# Altium schematic sheet MCP23017_PINOUT.SchDoc
size B; SheetNumber: 11; SheetTotal: 15
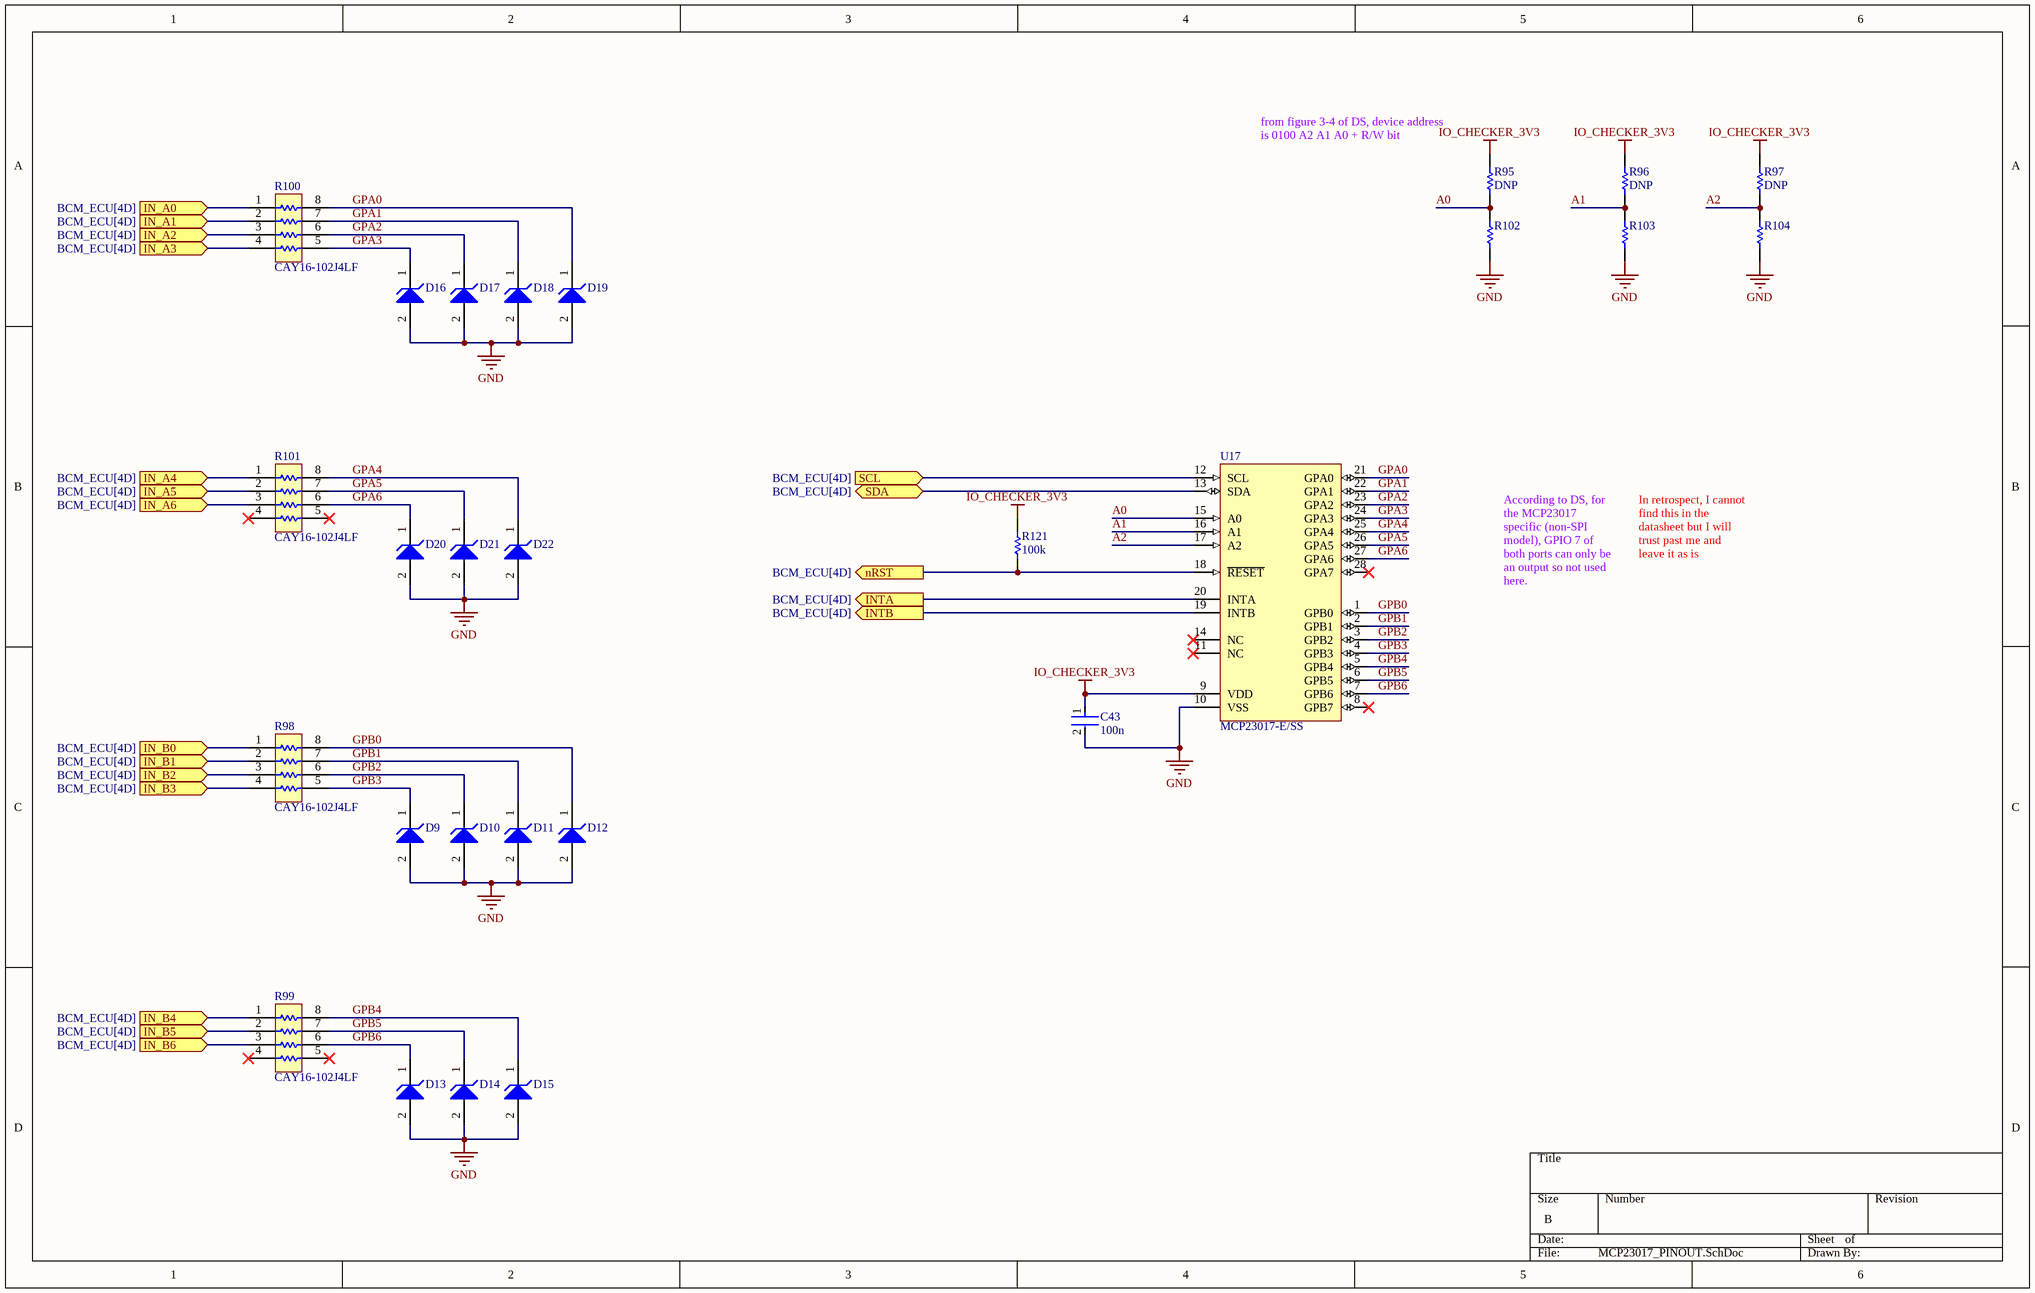
[diagram p0: MCP23017_PINOUT.SchDoc]

## Parts
C43  100n  [FP-0402-L_1_0_0_05-W_0_5-IPC_A]
D9  MM5Z3V3T1G  [ONSC-SOD-523-2-502-01_V]  (value not drawn)
D10  MM5Z3V3T1G  [ONSC-SOD-523-2-502-01_V]  (value not drawn)
D11  MM5Z3V3T1G  [ONSC-SOD-523-2-502-01_V]  (value not drawn)
D12  MM5Z3V3T1G  [ONSC-SOD-523-2-502-01_V]  (value not drawn)
D13  MM5Z3V3T1G  [ONSC-SOD-523-2-502-01_V]  (value not drawn)
D14  MM5Z3V3T1G  [ONSC-SOD-523-2-502-01_V]  (value not drawn)
D15  MM5Z3V3T1G  [ONSC-SOD-523-2-502-01_V]  (value not drawn)
D16  MM5Z3V3T1G  [ONSC-SOD-523-2-502-01_V]  (value not drawn)
D17  MM5Z3V3T1G  [ONSC-SOD-523-2-502-01_V]  (value not drawn)
D18  MM5Z3V3T1G  [ONSC-SOD-523-2-502-01_V]  (value not drawn)
D19  MM5Z3V3T1G  [ONSC-SOD-523-2-502-01_V]  (value not drawn)
D20  MM5Z3V3T1G  [ONSC-SOD-523-2-502-01_V]  (value not drawn)
D21  MM5Z3V3T1G  [ONSC-SOD-523-2-502-01_V]  (value not drawn)
D22  MM5Z3V3T1G  [ONSC-SOD-523-2-502-01_V]  (value not drawn)
R95  DNP  [R0603B]
R96  DNP  [R0603B]
R97  DNP  [R0603B]
R98  CAY16-102J4LF  [BOUR-CAY16-J4_V]
R99  CAY16-102J4LF  [BOUR-CAY16-J4_V]
R100  CAY16-102J4LF  [BOUR-CAY16-J4_V]
R101  CAY16-102J4LF  [BOUR-CAY16-J4_V]
R102  DNP  [RESC1005X40X25ML05T05]  (value not drawn)
R103  DNP  [RESC1005X40X25ML05T05]  (value not drawn)
R104  DNP  [RESC1005X40X25ML05T05]  (value not drawn)
R121  100k  [R0603B]
U17  MCP23017-E/SS  [SSOP-SS28_N]

## Ports
IN_A0 (in, see BCM_ECU[4D]), IN_A1 (in, see BCM_ECU[4D]), IN_A2 (in, see BCM_ECU[4D]), IN_A3 (in, see BCM_ECU[4D]), IN_A4 (in, see BCM_ECU[4D]), IN_A5 (in, see BCM_ECU[4D]), IN_A6 (in, see BCM_ECU[4D]), IN_B0 (in, see BCM_ECU[4D]), IN_B1 (in, see BCM_ECU[4D]), IN_B2 (in, see BCM_ECU[4D]), IN_B3 (in, see BCM_ECU[4D]), IN_B4 (in, see BCM_ECU[4D]), IN_B5 (in, see BCM_ECU[4D]), IN_B6 (in, see BCM_ECU[4D]), INTA (out, see BCM_ECU[4D]), INTB (out, see BCM_ECU[4D]), nRST (out, see BCM_ECU[4D]), SCL (in, see BCM_ECU[4D]), SDA (bidir, see BCM_ECU[4D])

## Nets
GND: C43.2 D9.2(A) D10.2(A) D11.2(A) D12.2(A) D13.2(A) D14.2(A) D15.2(A) D16.2(A) D17.2(A) D18.2(A) D19.2(A) D20.2(A) D21.2(A) D22.2(A) R102.1 R103.1 R104.1 U17.10(VSS)
IO_CHECKER_3V3: C43.1 R95.2 R96.2 R97.2 R121.2 U17.9(VDD)
A0: R95.1 R102.2 U17.15(A0)
A1: R96.1 R103.2 U17.16(A1)
A2: R97.1 R104.2 U17.17(A2)
GPA0: D19.1(K) R100.8 U17.21(GPA0)
GPA1: D18.1(K) R100.7 U17.22(GPA1)
GPA2: D17.1(K) R100.6 U17.23(GPA2)
GPA3: D16.1(K) R100.5 U17.24(GPA3)
GPA4: D22.1(K) R101.8 U17.25(GPA4)
GPA5: D21.1(K) R101.7 U17.26(GPA5)
GPA6: D20.1(K) R101.6 U17.27(GPA6)
GPB0: D12.1(K) R98.8 U17.1(GPB0)
GPB1: D11.1(K) R98.7 U17.2(GPB1)
GPB2: D10.1(K) R98.6 U17.3(GPB2)
GPB3: D9.1(K) R98.5 U17.4(GPB3)
GPB4: D15.1(K) R99.8 U17.5(GPB4)
GPB5: D14.1(K) R99.7 U17.6(GPB5)
GPB6: D13.1(K) R99.6 U17.7(GPB6)
IN_A0: R100.1 ; port IN_A0
IN_A1: R100.2 ; port IN_A1
IN_A2: R100.3 ; port IN_A2
IN_A3: R100.4 ; port IN_A3
IN_A4: R101.1 ; port IN_A4
IN_A5: R101.2 ; port IN_A5
IN_A6: R101.3 ; port IN_A6
IN_B0: R98.1 ; port IN_B0
IN_B1: R98.2 ; port IN_B1
IN_B2: R98.3 ; port IN_B2
IN_B3: R98.4 ; port IN_B3
IN_B4: R99.1 ; port IN_B4
IN_B5: R99.2 ; port IN_B5
IN_B6: R99.3 ; port IN_B6
INTA: U17.20(INTA) ; port INTA
INTB: U17.19(INTB) ; port INTB
nRST: R121.1 U17.18(~{RESET}) ; port nRST
SCL: U17.12(SCL) ; port SCL
SDA: U17.13(SDA) ; port SDA

Not connected (* = marked no-connect by the designer): R99 4* 5*; R101 4* 5*; U17 8(GPB7)* 11(NC)* 14(NC)* 28(GPA7)*

## Notes on the sheet
- (near R95) from figure 3-4 of DS, device address is 0100 A2 A1 A0 + R/W bit
- According to DS, for the MCP23017 specific (non-SPI model), GPIO 7 of both ports can only be an output so not used here.
- In retrospect, I cannot find this in the datasheet but I will trust past me and leave it as is

## Library data of the parts
C43 = CMP-001-00058-1: LARGE PADS, 0402 CAP, CHANGE COMMENT TO MATCH REAL P/N; Capacitor Type: Ceramic; Min Operating Temperature: -55°C; Mounting Technology: Surface Mount; Pins: 2; Case/Package: 0402; RoHS Compliant: Yes; Max Operating Temperature: 85°C
D9-D22 = CMP-1060-00750-1: Zener Voltage Regulator, 500 mW, 2-Pin SOD-523, Pb-Free, Tape and Reel; Manufacturer: On Semiconductor; P Max (W): 0.5; VZ Typ (V): 3.3; RoHS: Pb-Free; ComponentLink2Description: Datasheet; PackageReference: SOD-523-2-502-01; DatasheetVersion: Rev. 10; ComponentLink1Description: Manufacturer URL; PackageVersion: Rev. E, 09/2010; ComponentLink3URL: http://www.onsemi.com/pub_link/Collateral/502-01.PDF; ComponentLink2URL: http://www.onsemi.cn/pub_link/Collateral/MM5Z2V4T1-D.PDF; Mounting Technology: Surface Mount; PartNumber: MM5Z3V3T1G; Packing: Tape and Reel; PackageDescription: 2-Pin SOD, Body 1.2 x 0.8 mm; ComponentLink1URL: http://www.onsemi.com/; ComponentLink3Description: Package Specification
R95-R97 = CMP-009-00002-14: Resistor; Value: 100k
R98-R101 = CMP-1747-00007-1: Chip Resistor Array, 1 KOhm, +/- 5%, 62.5 mW, -55 to 125 degC, 8-Pin SMD, RoHS, Tape and Reel; Power Rating: 100 mW; Tolerance: 1%; Voltage Rating (DC): 50 V; Resistance: 330 Ohm; Case\Package: 0603; RoHSCompliant: true; Case Code (Metric): 1608; Pins: 2; PackageDescription: 8-Pin Surface Mount Device, Body 1.6 x 3.2 mm, Pitch 0.8 mm; Height: 0.45 mm; Min Operating Temperature: -55 degC; ComponentLink1URL: http://www.bourns.com/; Case Code (Imperial): 0603; Packaging: Tape and Reel; PackageReference: CAY16-J4; ComponentLink1Description: Manufacturer URL; ComponentLink2Description: Datasheet; Length: 1.6 mm; Width: 0.8 mm; Max Operating Temperature: 155 degC; Mount: Surface Mount; DatasheetVersion: Sep-14; Voltage Rating: 50 V; REACH SVHC: No SVHC; ComponentLink2URL: http://www.bourns.com/pdfs/CATCAY.pdf; Package Quantity: 5000
R102-R104 = CMP-009-00118-2: READ THE NAME; Pins: 2; Component Type: Standard; Design Item ID: CMP-009-00206-2; Source: 0402jump.SchLib
R121 = CMP-009-00002-14: Resistor; Value: 100k
U17 = CMP-0186-00176-2: 16-Bit I/O Expander with Serial Interface, 28-Pin SSOP, Extended Temperature; PackageVersion: revBB, Aug-2009; ComponentLink1Description: Manufacturer URL; ComponentLink3Description: Package Specification; PackageDescription: 28-Lead Plastic Shrink Small Outline (SS) - 5.3mm Body [SSOP]; ComponentLink1URL: http://www.microchip.com/; Code_JEDEC: MS-150; RevisionNote: URLs added.; ComponentLink3URL: http://www.microchip.com/stellent/groups/techpub_sg/documents/packagingspec/en012702.pdf; ComponentLink2URL: http://ww1.microchip.com/downloads/en/DeviceDoc/21952b.pdf; ComponentLink2Description: Datasheet; PackageReference: SSOP-SS28; DatasheetVersion: revB, Feb-2007